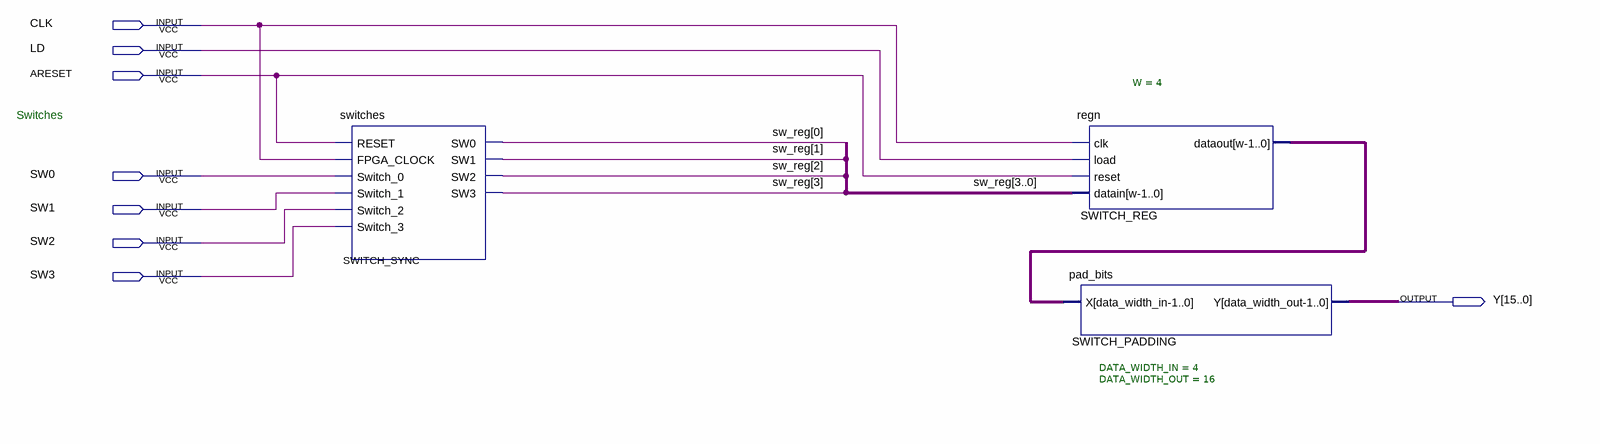
[diagram p0: schematic sheet]
// Quartus schematic switch_dataflow.bdf as structural Verilog: 3 symbols, 8 pins
module switch_dataflow (
  input  CLK,
  input  LD,
  input  ARESET,
  input  SW0,
  input  SW1,
  input  SW2,
  input  SW3,
  output [15:0] Y
);

  wire [3:0] sw_reg, SWITCH_REG_dataout;

  switches SWITCH_SYNC (
    .RESET(ARESET), .FPGA_CLOCK(CLK), .Switch_0(SW0), .Switch_1(SW1), .Switch_2(SW2), .Switch_3(SW3),
    .SW0(sw_reg[0]), .SW1(sw_reg[1]), .SW2(sw_reg[2]), .SW3(sw_reg[3]));
  regn #(.W(4)) SWITCH_REG (.clk(CLK), .load(LD), .reset(ARESET), .datain(sw_reg), .dataout(SWITCH_REG_dataout));
  pad_bits #(.DATA_WIDTH_IN(4), .DATA_WIDTH_OUT(16)) SWITCH_PADDING (.X(SWITCH_REG_dataout), .Y(Y));

  // Notes on the sheet:
  //   Switches
endmodule
